# Altium schematic sheet ConvertidorBuck.SchDoc
size A4; SheetNumber: 1; SheetTotal: 1
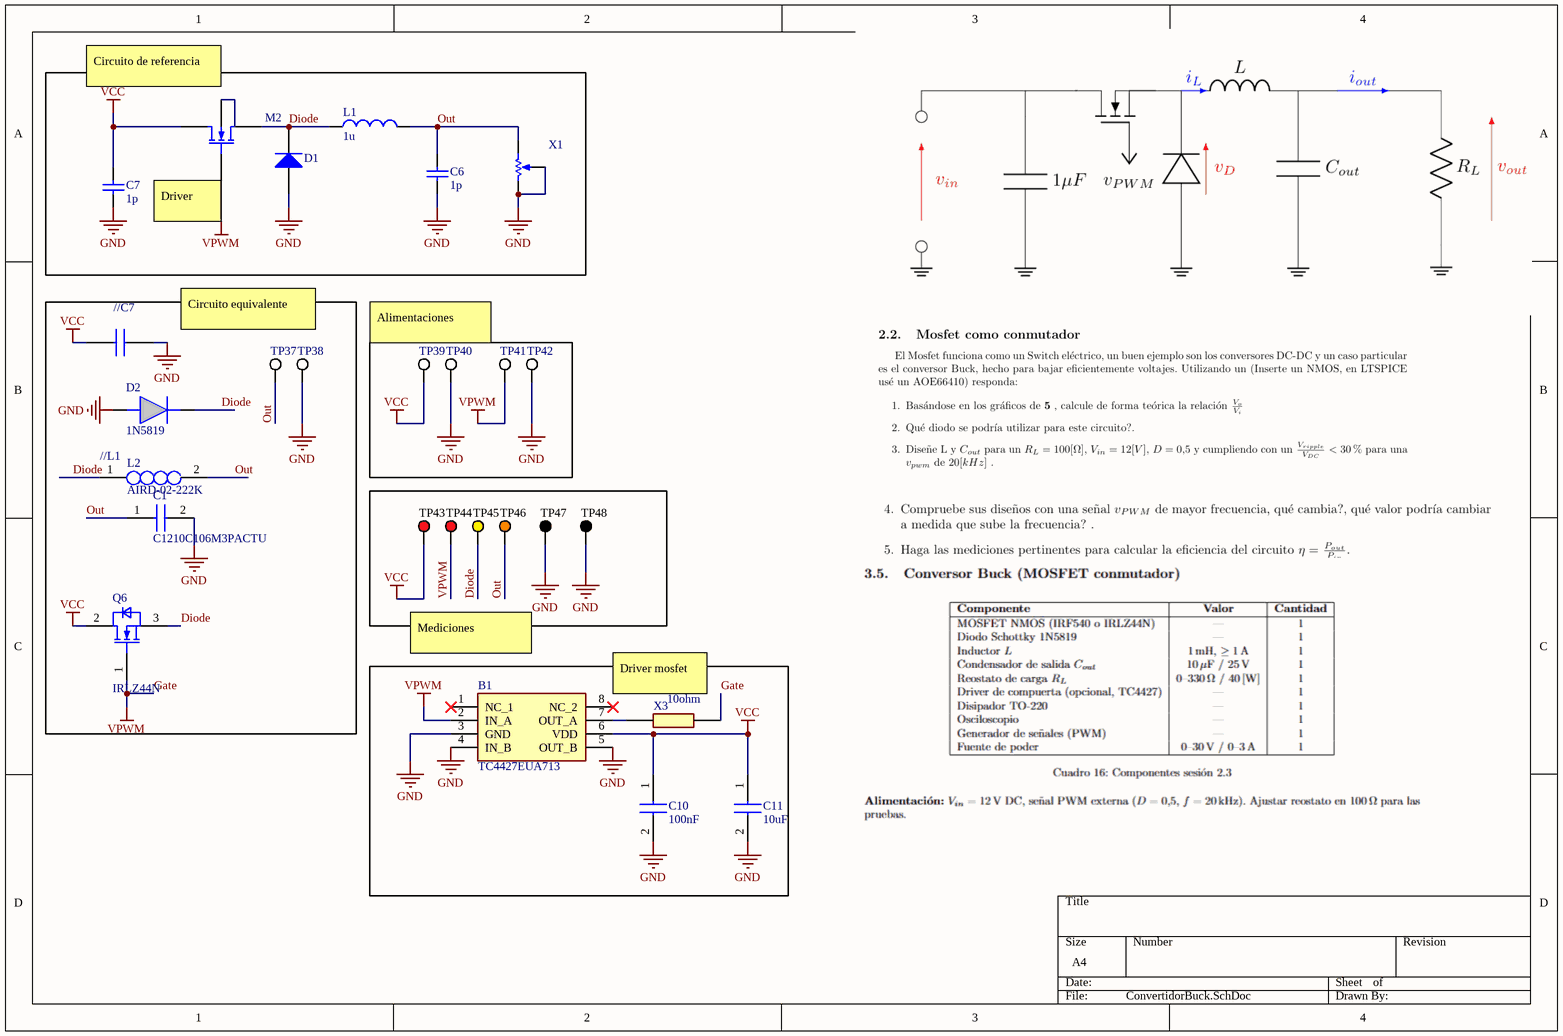
[diagram p0: ConvertidorBuck.SchDoc]

## Parts
B1  TC4427EUA713  [SOP65P490X110-8N]
C1  C1210C106M3PACTU  [C1210]
C6  value 1p  (hidden comment: Capacitor)
C7  value 1p  (hidden comment: Capacitor)
C8  C1206C105K3RAC7800  [CAPC3216X140N]  (value not drawn)
C10  100nF  [C0603]
C11  10uF  [C1210]
D1  Diode  (value not drawn)
D2  1N5819  [DIOAD1408W86L464D236]
L1  value 1u  (hidden comment: Inductor)
L2  AIRD-02-222K  [AIRD-02]
M2  N-channel MOS1 MOSFET Shichman and Hodges Model  (value not drawn)
Q6  IRLZ44N  [IFX-PG-TO220-3-904-1]
TP37  575-4  [KSTN-575-4]  (value not drawn)
TP38  575-4  [KSTN-575-4]  (value not drawn)
TP39  575-4  [KSTN-575-4]  (value not drawn)
TP40  575-4  [KSTN-575-4]  (value not drawn)
TP41  575-4  [KSTN-575-4]  (value not drawn)
TP42  575-4  [KSTN-575-4]  (value not drawn)
TP43  5010  [KSTN-5010_V]  (value not drawn)
TP44  5010  [KSTN-5010_V]  (value not drawn)
TP45  5014  [KSTN-5014_V]  (value not drawn)
TP46  5013  [KSTN-5013_V]  (value not drawn)
TP47  5011  [KSTN-5011_V]  (value not drawn)
TP48  5011  [KSTN-5011_V]  (value not drawn)
X1  Potentiometer  (value not drawn)
X3  10ohm  [RESC3216X60N]

## Nets
Gate: B1.2(IN_A) M2.2(G) Q6.1(GATE) TP41.1 TP44.1 X3.2  [also labelled VPWM]
GND: B1.3(GND) B1.4(IN_B) B1.5(OUT_B) C1.2 C6.2 C7.2 C8.2 C10.2 C11.2 D1.1(A) D2.2(A) TP38.1 TP40.1 TP42.1 TP47.1 TP48.1 X1.2(BOT) X1.3(TAP)
VCC: B1.6(VDD) C7.1 C8.1 C10.1 C11.1 M2.1(D) Q6.2(DRAIN) TP39.1 TP43.1
Diode: D1.2(K) D2.1(K) L1.1 L2.1 M2.3(S) Q6.3(SOURCE) TP45.1
Out: C1.1 C6.1 L1.2 L2.2 TP37.1 TP46.1 X1.1(TOP)
NetB1_7: B1.7(OUT_A) X3.1

Not connected (* = marked no-connect by the designer): B1 1(NC_1)* 8(NC_2)*; M2 4(B)

## Notes on the sheet
- (near M2) Circuito de referencia
- Driver
- (near C8) //C7
- Circuito equivalente
- Alimentaciones
- (near L2) //L1
- Mediciones
- Driver mosfet

## Library data of the parts
B1 = TC4427EUA713: TC4427A Series 1.5 A 18 Vmax 7 Ohm Dual Non Inverting MOSFET Driver - MSOP-8; Manufacturer_Name: Microchip; Geometry.Height: 1.1mm; Mouser Part Number: 579-TC4427EUA713; Mouser Price/Stock: https://www.mouser.co.uk/ProductDetail/Microchip-Technology/TC4427EUA713?qs=6pREnGtJ7gG%2Fg%252Bua4Jcb3A%3D%3D; Manufacturer_Part_Number: TC4427EUA713; Datasheet Link: https://ww1.microchip.com/downloads/en/DeviceDoc/20001422G.pdf
C1 C11 = C1210C106M3PACTU: Capacitor; Manufacturer_Name: Yageo Group; Datasheet Link: https://www.yageogroup.com/content/datasheet/asset/file/KEM_C1006_X5R_SMD; Manufacturer_Part_Number: C1210C106M3PACTU; Mouser Part Number: 80-C1210C106M3P; Mouser Price/Stock: https://www.mouser.com/Search/Refine.aspx?Keyword=80-C1210C106M3P
C6 C7 = Capacitor: SimulationGenericComponent: True
C8 = C1206C105K3RAC7800: Multilayer Ceramic Capacitors MLCC - SMD/SMT 25V 1uF X7R 1206 10%; Manufacturer_Name: Yageo Group; Geometry.Height: 1.4mm; Mouser Part Number: 80-C1206C105K3R7800; Mouser Price/Stock: https://www.mouser.co.uk/ProductDetail/KEMET/C1206C105K3RAC7800?qs=9Bh1%2FLvCqWR5qBTiXKKjKA%3D%3D; Manufacturer_Part_Number: C1206C105K3RAC7800; Datasheet Link: https://connect.kemet.com:7667/gateway/IntelliData-ComponentDocumentation/1.0/download/specsheet/C1206C105K3RACTU
C10 = C0603X104M3RACTU: Capacitor; Manufacturer_Name: Yageo Group; Datasheet Link: https://www.yageogroup.com/content/datasheet/asset/file/KEM_C1013_X7R_FT-CAP_SMD; Height: 0.87mm; Manufacturer_Part_Number: C0603X104M3RACTU; Mouser Part Number: 80-C0603X104M3R; Mouser Price/Stock: https://www.mouser.co.uk/ProductDetail/KEMET/C0603X104M3RACTU?qs=p6yRp5s%252B%2FXSQKNqxiIj6xg%3D%3D; Arrow Part Number: C0603X104M3RACTU; Arrow Price/Stock: https://www.arrow.com/en/products/c0603x104m3ractu/kemet-corporation
D1 = Diode: AF: 1; BV: 0; BV_MAX: 1e99; EG: 1.11; FC: 0.5; IBV: 0.001; ISR: 1e-14; MJSW: 0.33; NTUN: 30; TNOM: 27; XTI: 3; SimulationGenericComponent: True; CJO: 0; CJP: 0; CTA: 0; CTP: 0; FCS: 0.5; FV_MAX: 1e99; IKF: 0; IKR: 0; JSW: 0; JTUN: 0; JTUNSW: 0; KEG: 1; KF: 0; LEVEL: 1; N: 1; NBV: 1; NR: 1; NS: 1; PHP: 1; RS: 0; TCV: 0; TLEV: 0; TLEVC: 0; TM1: 0; TM2: 0; TPB: 0; TPHP: 0; TRS: 0; TRS2: 0; TT: 0; TTT1: 0; TTT2: 0; VJ: 1; XTITUN: 3; IS: 1e-14
D2 = 1N5819: Schottky Barrier Rectifier Diodes; Manufacturer_Name: Diotec; Mouser Part Number: 637-1N5819; Mouser Price/Stock: https://www.mouser.co.uk/ProductDetail/Diotec-Semiconductor/1N5819?qs=OlC7AqGiEDlzWAEqP18zhw%3D%3D; Manufacturer_Part_Number: 1N5819; Datasheet Link: https://www.diodes.com/assets/Datasheets/ds23001.pdf
L1 = Inductor: SimulationGenericComponent: True
L2 = AIRD-02-222K: Inductor; Manufacturer_Name: ABRACON; Datasheet Link: https://abracon.com/Magnetics/radial/AIRD02.pdf; Height: 21mm; Manufacturer_Part_Number: AIRD-02-222K; Mouser Part Number: 815-AIRD-02-222K; Mouser Price/Stock: https://www.mouser.co.uk/ProductDetail/ABRACON/AIRD-02-222K?qs=qV1JnYL3zOzbPmurb06pXg%3D%3D; Arrow Part Number: AIRD-02-222K; Arrow Price/Stock: https://www.arrow.com/en/products/aird-02-222k/abracon
M2 = MOSFET N-ch Lev1: CBD: 0; FC: 0.5; IS: 1e-14; KP: 2e-05; PB: 0.8; PHI: 0.6; TNOM: 27; SimulationGenericComponent: True; CBS: 0; CGBO: 0; CGDO: 0; CGSO: 0; CJ: 0; CJSW: 0; GAMMA: 0; JS: 0; LAMBDA: 0; LD: 0; MJ: 0.5; MJSW: 0.5; NSS: 0; NSUB: 0; RD: 0; RS: 0; RSH: 0; TOX: 0; TPG: 0; U0: 0; VTO: 0
Q6 = IRLZ44N: OptiMOS 3 Power-Transistor, VDS 100V; Manufacturer: Infineon Technologies; Manufacturer Order Number: IRLZ44N; PackageReference: PG-TO220-3-904
TP37-TP42 = CMP-2000-05649-1: Banana Jack, Non-Insulated, 1-Pin THD, RoHS, Bulk; Manufacturer: Keystone-Electronics; Package Version: Rev. B, 11/1994; Plug/Mating Plug Diameter: StandardBanana; Gender: Female; Package Reference: 575-4; Operating Temperature: -; Contact Material: Brass; Packaging: Bulk; Series: -; Category: Connectors,Interconnects; Color: -; Type: BananaJack; Contact Finish: Nickel; Features: -; Family: BananaandTipConnectors-Jacks,Plugs; Body Material: -; Manufacturer URL: http://www.keyelco.com/; Termination: Solder; Insulation: Non-Insulated; Datasheet Version: Rev. B, 11/1994; Mounting Technology: ThroughHole; Package URL: http://www.keyelco.com/product-pdf.cfm?p=2379; Mounting Type: ThroughHole; Package Description: 1-Pin Through Hole Device, Dia 7.92 mm; Datasheet URL: http://www.keyelco.com/product-pdf.cfm?p=2379; Wire Gauge: -
TP43 TP44 = CMP-1672-00002-4: Test Point, Red, Through Hole, RoHS, Bulk; Manufacturer: Keystone; Contact Material: Bronze; Mounting Technology: Through Hole; RoHSCompliant: true; Pins: 1; Package Quantity: 100; ComponentLink2Description: Datasheet; Height: 8.12 mm; ComponentLink1URL: http://www.keyelco.com/; DatasheetVersion: Rev. F, 12/2013; Mount: Through Hole; PackageReference: 5010; Contact Plating: Silver; Packaging: Bulk; Colour: Red; REACH SVHC: No SVHC; PackageDescription: 1-Pin Through Hole Device, Dia 3.17 mm; ComponentLink2URL: http://www.keyelco.com/product-pdf.cfm?p=1319; ComponentLink1Description: Manufacturer URL
TP45 = CMP-1672-00006-4: Test Point, Yellow, Through Hole, RoHS, Bulk; Manufacturer: Keystone; PackageDescription: 1-Pin Through Hole Device, Dia 3.17 mm; REACH SVHC: No SVHC; ComponentLink2Description: Datasheet; ComponentLink2URL: http://www.keyelco.com/product-pdf.cfm?p=1323; Package Quantity: 100; Colour: Yellow; Height: 8.12 mm; RoHSCompliant: true; Contact Material: Bronze; Mount: Through Hole; Contact Plating: Silver; ComponentLink1URL: http://www.keyelco.com/; Packaging: Bulk; Mounting Technology: Through Hole; PackageReference: 5014; ComponentLink1Description: Manufacturer URL; DatasheetVersion: Rev. F, 12/2013
TP46 = CMP-1672-00005-4: Test Point, Orange, Through Hole, RoHS, Bulk; Manufacturer: Keystone; REACH SVHC: No SVHC; ComponentLink2Description: Datasheet; PackageDescription: 1-Pin Through Hole Device, Dia 3.17 mm; Package Quantity: 100; PackageReference: 5013; Contact Material: Bronze; DatasheetVersion: Rev. F, 12/2013; ComponentLink2URL: http://www.keyelco.com/product-pdf.cfm?p=1322; Contact Plating: Silver; ComponentLink1URL: http://www.keyelco.com/; Packaging: Bulk; ComponentLink1Description: Manufacturer URL; Colour: Orange; Height: 8.12 mm; RoHSCompliant: True; Mount: Through Hole; Mounting Technology: Through Hole
TP47 TP48 = CMP-1672-00003-4: Test Point, Black, Through Hole, RoHS, Bulk; Manufacturer: Keystone; ComponentLink2URL: http://www.keyelco.com/product-pdf.cfm?p=1320; Colour: Black; Pins: 1; REACH SVHC: No SVHC; ComponentLink1URL: http://www.keyelco.com/; PackageReference: 5011; Contact Plating: Silver; Package Quantity: 100; Packaging: Bulk; RoHSCompliant: true; Height: 8.12 mm; PackageDescription: 1-Pin Through Hole Device, Dia 3.17 mm; Mount: Through Hole; Mounting Technology: Through Hole; DatasheetVersion: Rev. F, 12/2013; ComponentLink1Description: Manufacturer URL; Contact Material: Bronze; ComponentLink2Description: Datasheet
X1 = Potentiometer: value: 1k; position: 0.5; SimulationGenericComponent: True
X3 = CRCW120610R0FKTC: Standard Thick Film Chip Resistors value 10R0 ohm.; Manufacturer_Name: Vishay; Geometry.Height: 0.6mm; Mouser Part Number: *; Mouser Price/Stock: *; Manufacturer_Part_Number: CRCW120610R0FKTC; Datasheet Link: *